# EAGLE design Xduino8.0 (EAGLE 6.5.0)
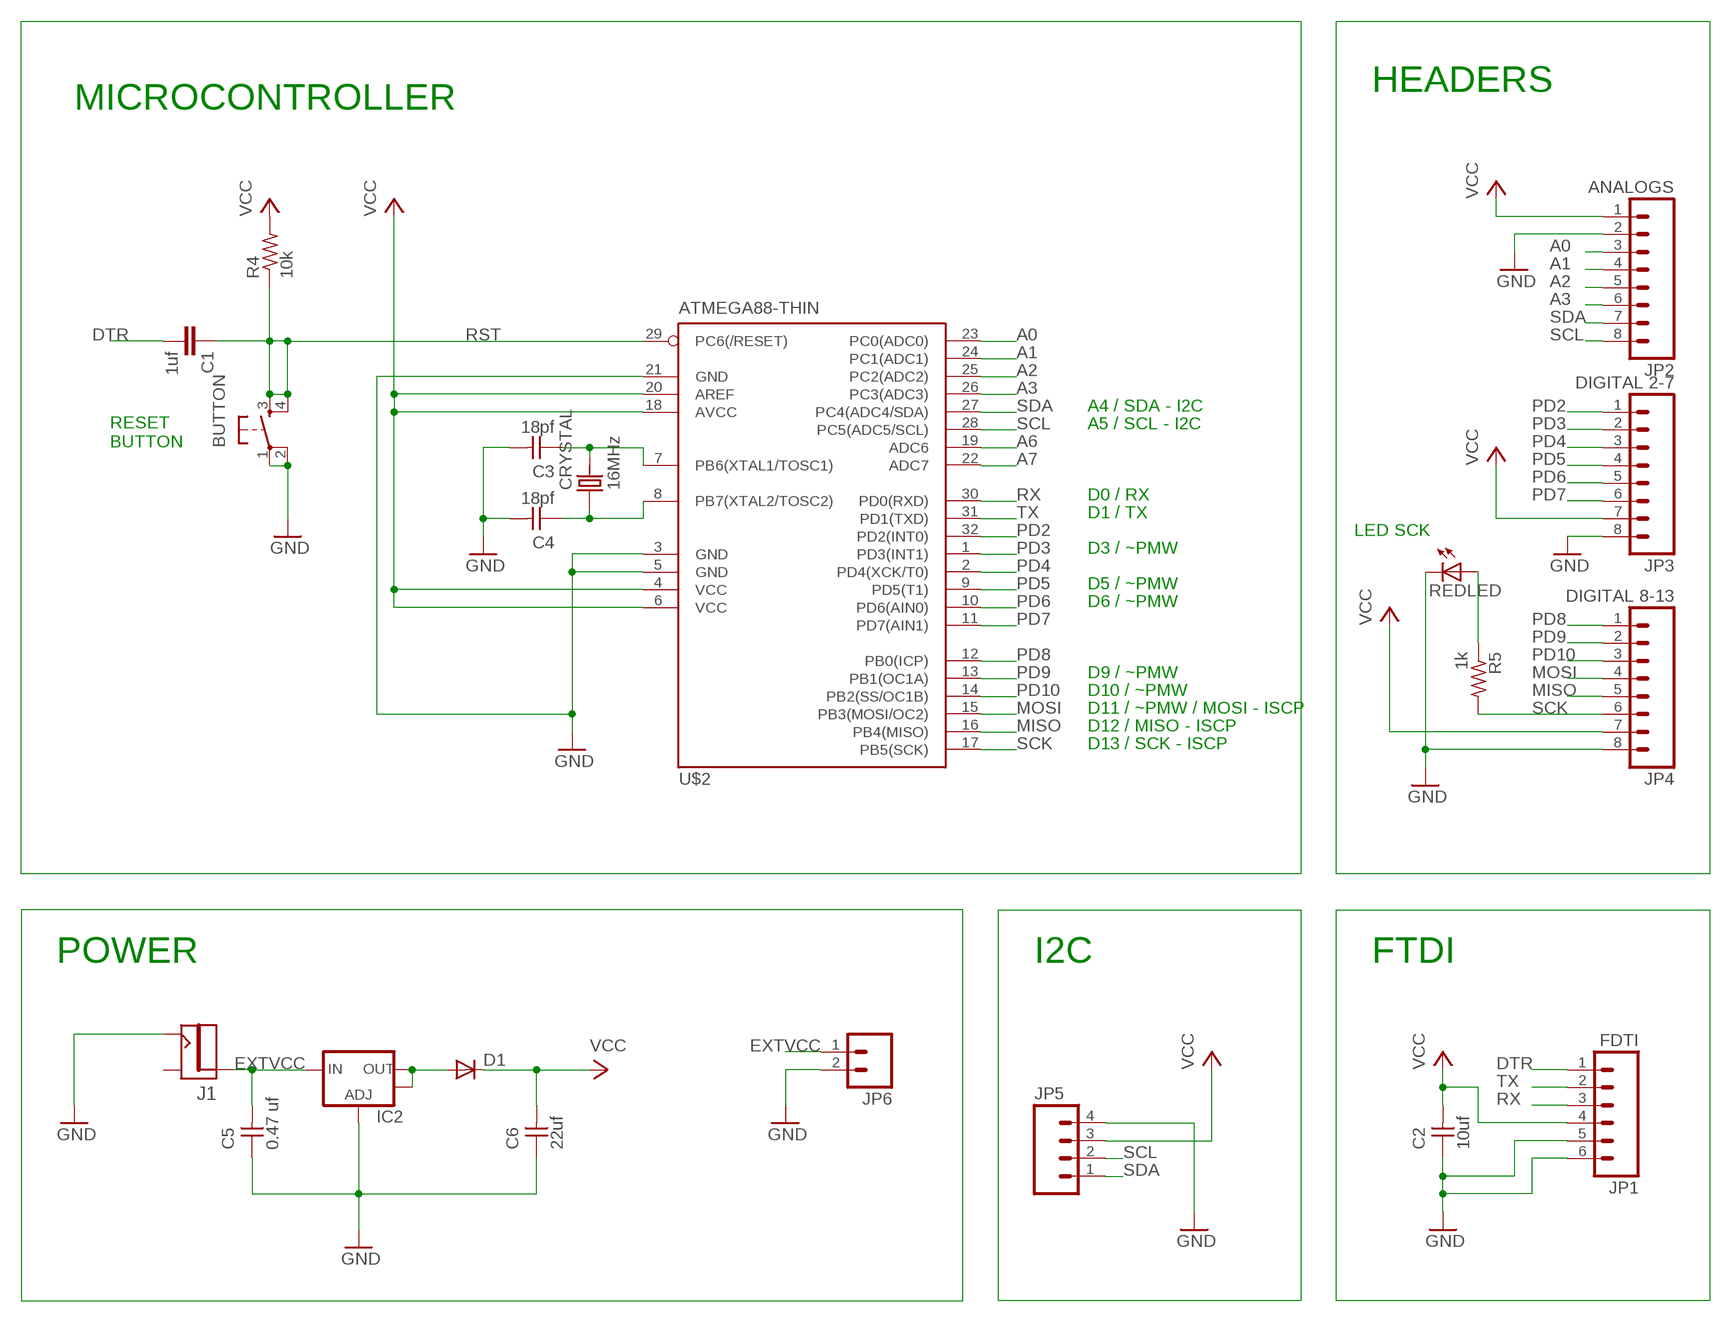
[diagram p0: schematic, sheet 1]

## Parts
BUTTON  6MM_SWITCH6MM_SWITCH  [6MM_SWITCH]
C1  1uf  CAP1206  [1206]
C2  10uf  UNPOLARIZED_CAPACITOR1206  [1206]
C3  18pf  UNPOLARIZED_CAPACITOR1206  [1206]
C4  18pf  UNPOLARIZED_CAPACITOR1206  [1206]
C5  0.47 uf  UNPOLARIZED_CAPACITOR1206  [1206]
C6  22uf  UNPOLARIZED_CAPACITOR1206  [1206]
CRYSTAL  16MHz  CRYSTALCS10  [CS10]
D1  DIODESOD123  [SOD123]
IC2  V_REG_LM1117SOT223  [SOT223]
J1  JACK.65MM  [JACK_.65MM]
JP1  FDTI  M061X06-SMD_EDGE_FEMALE  [1X06-SMD_EDGE]
JP2  ANALOGS  M08  [1X08]
JP3  DIGITAL 2-7  M08  [1X08]
JP4  DIGITAL 8-13  M08  [1X08]
JP5  M04PTH  [1X04]
JP6  M02PTH  [1X02]
R4  10k  RESISTOR1206  [1206]
R5  1k  RESISTOR1206  [1206]
REDLED  LED1206  [1206]
U$2  ATMEGA88-THIN  [TQFP32-08THIN]

## Nets
A0: JP2.3 U$2.23(PC0(ADC0))
A1: JP2.4 U$2.24(PC1(ADC1))
A2: JP2.5 U$2.25(PC2(ADC2))
A3: JP2.6 U$2.26(PC3(ADC3))
A6: U$2.19(ADC6)
A7: U$2.22(ADC7)
DTR: C1.2 JP1.1
EXTVCC: C5.2 IC2.3(IN) J1.PIN JP6.1
GND: BUTTON.1(P) BUTTON.2(P1) C2.1 C3.2 C4.2 C5.1 C6.1 IC2.1(ADJ) J1.SHUNT(CONTACT) JP1.5 JP1.6 JP2.2 JP3.8 JP4.8 JP5.4 JP6.2 REDLED.2(C) U$2.3(GND) U$2.5(GND) U$2.21(GND)
MISO: JP4.5 U$2.16(PB4(MISO))
MOSI: JP4.4 U$2.15(PB3(MOSI/OC2))
N$2: R5.1 REDLED.1(A)
N$10: C4.1 CRYSTAL.P$1 U$2.8(PB7(XTAL2/TOSC2))
N$11: C3.1 CRYSTAL.P$2 U$2.7(PB6(XTAL1/TOSC1))
N$12: D1.ANODE(A) IC2.2(OUT) IC2.4(OUT)
PD2: JP3.1 U$2.32(PD2(INT0))
PD3: JP3.2 U$2.1(PD3(INT1))
PD4: JP3.3 U$2.2(PD4(XCK/T0))
PD5: JP3.4 U$2.9(PD5(T1))
PD6: JP3.5 U$2.10(PD6(AIN0))
PD7: JP3.6 U$2.11(PD7(AIN1))
PD8: JP4.1 U$2.12(PB0(ICP))
PD9: JP4.2 U$2.13(PB1(OC1A))
PD10: JP4.3 U$2.14(PB2(SS/OC1B))
RST: BUTTON.3(S) BUTTON.4(S1) C1.1 R4.1 U$2.29(PC6(/RESET))
RX: JP1.3 U$2.30(PD0(RXD))
SCK: JP4.6 R5.2 U$2.17(PB5(SCK))
SCL: JP2.8 JP5.2 U$2.28(PC5(ADC5/SCL))
SDA: JP2.7 JP5.1 U$2.27(PC4(ADC4/SDA))
TX: JP1.2 U$2.31(PD1(TXD))
VCC: C2.2 C6.2 D1.CATHODE(C) JP1.4 JP2.1 JP3.7 JP4.7 JP5.3 R4.2 U$2.4(VCC) U$2.6(VCC) U$2.18(AVCC) U$2.20(AREF)
Unconnected: J1.CONTACT(SHUNT)

## Notes on the sheet
- HEADERS
- MICROCONTROLLER
- A4 / SDA - I2C
- A5 / SCL - I2C
- RESET 
  BUTTON
- D0 / RX
- D1 / TX
- LED SCK
- D3 / ~PMW
- D5 / ~PMW
- D6 / ~PMW
- D9 / ~PMW
- D10 / ~PMW
- D11 / ~PMW / MOSI - ISCP
- D12 / MISO - ISCP
- D13 / SCK - ISCP
- POWER | I2C | FTDI

## Library data of the parts
BUTTON = 01_fab:6MM_SWITCH: OMRON SWITCH
C1 = 01_SparkFun:CAP: Capacitor Standard 0603 ceramic capacitor, and 0.1" leaded capacitor.
C2-C6 = 01_FAB_Hello:UNPOLARIZED_CAPACITOR: unpolarized_capacitor
CRYSTAL = 01_ng:CRYSTAL: CRYSTAL
D1 = 01_fab:DIODE: DIODE high speed (Philips)
IC2 = 01_SparkFun:V_REG_LM1117: Voltage Regulator LM1117 Standard adjustable voltage regulator but in SMD form. Spark Fun Electronics SKU : COM-00595
J1 = 01_fab:JACK
JP1 = 01_SparkFun:M06: Header 6 Standard 6-pin 0.1" header. Use with straight break away headers (SKU : PRT-00116), right angle break away headers (PRT-00553), swiss pins (PRT-00743), machine pins (PRT-00117), and female headers (PRT-00115). Molex polarized connector foot print use with SKU : PRT-08094 with associated crimp pins and housings. NOTES ON THE VARIANTS LOCK and LOCK_LONGPADS... This footprint was designed to help hold the alignment of a through-hole component (i.e. 6-pin header) while soldering it into place. You may notice that each hole has been shifted either up or down by 0.005 of an inch from it's more standard position (which is a perfectly straight line). This slight alteration caused the pins (the squares in the middle) to touch the edges of the holes. Because they are alternating, it causes a "brace" to hold the component in place. 0.005 has proven to be the perfect amount of "off-center" position when using our standard breakaway headers. Although looks a little odd when you look at the bare footprint, once you have a header in there, the alteration is very hard to notice. Also, if you push a header all the way into place, it is covered up entirely on the bottom side. This idea of altering the position of holes to aid alignment will be further integrated into the Sparkfun Library for other footprints. It can help hold any component with 3 or more connection pins.
JP2-JP4 = 01_SparkFun:M08: Header 8 Standard 8-pin 0.1" header. Use with straight break away headers (SKU : PRT-00116), right angle break away headers (PRT-00553), swiss pins (PRT-00743), machine pins (PRT-00117), and female headers (PRT-00115).
JP5 = 01_SparkFun:M04: Header 4 Standard 4-pin 0.1" header. Use with straight break away headers (SKU : PRT-00116), right angle break away headers (PRT-00553), swiss pins (PRT-00743), machine pins (PRT-00117), and female headers (PRT-00115). Molex polarized connector foot print use with SKU : PRT-08231 with associated crimp pins and housings.
JP6 = 01_SparkFun:M02: Header 2 Standard 2-pin 0.1" header. Use with straight break away headers (SKU : PRT-00116), right angle break away headers (PRT-00553), swiss pins (PRT-00743), machine pins (PRT-00117), and female headers (PRT-00115). Molex polarized connector foot print use with SKU : PRT-08233 with associated crimp pins and housings.
R4 = 01_FAB_Hello:RESISTOR
R5 = 01_ng:RESISTOR
REDLED = 01_ng:LED
U$2 = 01_fab:ATMEGA88-THIN

## Board
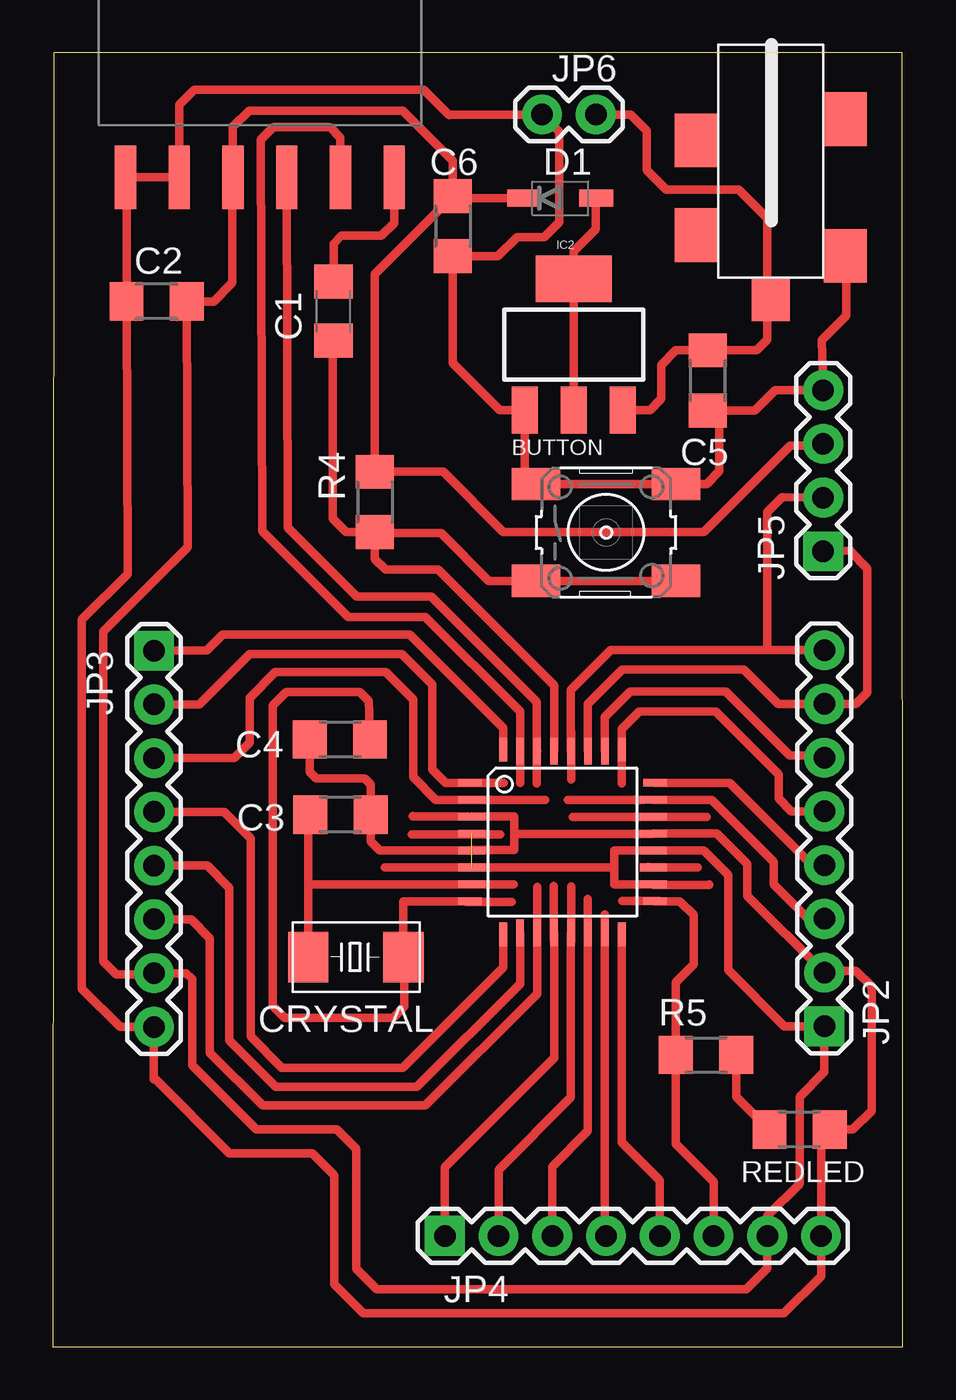
[diagram p1: board, top side]

Size 40.16 x 61.15 mm. Coordinates in mm from the lower left corner, seen from the top.
Outline: 0,0 40.16,0 40.13,61.15 0.05,61.15 0,0
Copper layers (1*16): Top 0.035mm / dielectric 1.5mm / Bottom 0.035mm
Design rules "default": minimum track width 10mil, minimum drill 24mil, track to track 8mil, track to pad 8mil, pad to pad 8mil, via to via 8mil, smd to smd 8mil, copper to edge 40mil, drill to drill 8mil, minimum pad ring 10mil, minimum via ring 8mil, stop-mask expansion 4mil, vias tented up to drill 0mil, thermal gap 10mil

### Footprints (pad centres in the part's own frame; a part is rotated, then mirrored left to right if it is on the bottom)
6MM_SWITCH = smd 2.286 x 1.524: 1 -3.302,2.286; 2 3.302,2.286; 3 -3.302,-2.286; 4 3.302,-2.286
1206 = smd 1.6 x 1.8: 1 -1.4,0; 2 1.4,0
1206' = smd 1.6 x 1.803: 1 -1.422,0; 2 1.422,0
CS10 = smd 1.905 x 2.388: P$1 -2.286,0; P$2 2.21,0
SOD123 = smd 1.6 x 0.8: ANODE 1.7,0; CATHODE -1.7,0
SOT223 = smd 1.219 x 2.235: 1 -2.311,-3.099; 2 0,-3.099; 3 2.311,-3.099 | smd 3.6 x 2.2: 4 0,3.099
JACK_.65MM = smd 2.032 x 2.54: CONTACT 3.578,4.026; SHIELD -3.45,-1.448; SHIELD1 3.578,-0.447; SHUNT -3.45,5.005 | smd 1.778 x 2.032: PIN 0.064,7.071
1X06-SMD_EDGE = smd 1 x 3: 1 0,-0.08; 2 2.54,-0.08; 3 5.08,-0.08; 4 7.62,-0.08; 5 10.16,-0.08; 6 12.7,-0.08
1X08 = drill 1.016 pad 1.88 square: 1 0,0 | drill 1.016 pad 1.88: 2 2.54,0; 3 5.08,0; 4 7.62,0; 5 10.16,0; 6 12.7,0; 7 15.24,0; 8 17.78,0
1X04 = drill 1.016 pad 1.88 square: 1 0,0 | drill 1.016 pad 1.88: 2 2.54,0; 3 5.08,0; 4 7.62,0
1X02 = drill 1.016 pad 1.88: 1 0,0; 2 2.54,0
TQFP32-08THIN = smd 1.118 x 0.356: 1 -4.369,2.8; 8 -4.369,-2.8; 17 4.369,-2.8; 24 4.369,2.8 | smd 1.27 x 0.356: 2 -4.293,2; 3 -4.293,1.2; 4 -4.293,0.4; 5 -4.293,-0.4; 6 -4.293,-1.2; 7 -4.293,-2; 18 4.293,-2; 19 4.293,-1.2; 20 4.293,-0.4; 21 4.293,0.4; 22 4.293,1.2; 23 4.293,2 | smd 0.356 x 1.118: 9 -2.8,-4.369; 16 2.8,-4.369; 25 2.8,4.369; 32 -2.8,4.369 | smd 0.356 x 1.27: 10 -2,-4.293; 14 1.2,-4.293; 15 2,-4.293; 26 2,4.293; 27 1.2,4.293; 31 -2,4.293 | smd 0.35 x 1.27: 11 -1.2,-4.293; 12 -0.4,-4.293; 13 0.4,-4.293; 28 0.4,4.293; 29 -0.4,4.293; 30 -1.2,4.293

### Placement (x,y rotation side)
BUTTON  26.14,38.48 0 top
C1  13.26,48.95 90 top
C2  10uf  [1206']  4.9,49.4 0 top
C3  18pf  [1206']  13.59,25.15 0 top
C4  18pf  [1206']  13.56,28.7 180 top
C5  0.47 uf  [1206']  30.94,45.67 90 top
C6  22uf  [1206']  18.9,52.96 90 top
CRYSTAL  14.27,18.41 180 top
D1  23.98,54.28 0 top
IC2  24.61,47.37 0 top
J1  33.99,56.57 180 top
JP1  16.13,55.19 180 top
JP2  36.45,15.14 90 top
JP3  4.78,32.89 270 top
JP4  18.52,5.23 0 top
JP5  36.4,37.59 90 top
JP6  25.65,58.24 180 top
R4  10k  [1206']  15.21,39.93 90 top
R5  1k  [1206']  30.86,13.79 180 top
REDLED  [1206']  35.28,10.26 0 top
U$2  24.08,23.85 0 top

### Tracks (layer width: path | path; a pad name or v marks a point on that pad's centre or on a via)
A0
  Top 0.406: U$2.23 31.12,25.85 34.06,22.91 34.06,21.84 35.69,20.22 JP2.3
A1
  Top 0.406: U$2.24 31.97,26.65 35.86,22.76 JP2.4
A2
  Top 0.406: U$2.25 26.88,29.19 27.71,30.02 31.32,30.02 34.29,27.05 34.29,25.91 34.9,25.3 JP2.5
A3
  Top 0.406: U$2.26 26.08,29.76 27.28,30.96 31.8,30.96 34.82,27.94 36.35,27.94 JP2.6
DTR
  Top 0.406: C1.2 13.26,52.15 13.61,52.5 15.52,52.5 16.13,53.11 JP1.1
EXTVCC
  Top 0.406: JP6.1 27.31,58.24 28.07,57.48 28.07,55.6 28.98,54.69 32.41,54.69 33.75,53.34 33.75,49.33 | 33.75,49.33 J1.PIN | 33.75,49.33 33.75,47.6 33.25,47.09 30.18,47.09 C5.2 29.44,47.09 28.75,46.41 28.75,44.81 28.22,44.27 IC2.3
GND
  Top 0.406: U$2.3 21.79,25.05 21.79,24.23 | 21.79,24.23 21.79,23.47 19.79,23.47 U$2.5 15.44,23.45 15.01,23.88 C3.2 | 21.79,24.23 28.37,24.23 U$2.21 31.38,24.25 32.82,22.81 32.82,21.31 JP2.2 36.53,17.75 37.95,17.75 38.68,17.02 38.68,11.15 37.8,10.26 REDLED.2 36.3,9.86 JP4.8 36.3,3.33 34.54,1.57 14.66,1.57 13.28,2.95 13.28,8.1 12.24,9.14 8.33,9.14 4.85,12.62 4.78,12.62 JP3.8 3.18,15.11 1.37,16.92 1.37,34.37 3.53,36.53 C2.1 3.48,55.22 JP1.6 JP1.5 5.97,58.7 6.65,59.39 6.73,59.41 17.53,59.41 18.72,58.22 18.75,58.24 JP6.2 23.93,57.43 23.93,53.16 23.22,52.45 21.95,52.45 21.03,51.54 C6.1 18.9,46.48 21.11,44.27 IC2.1 22.3,41.3 BUTTON.1 BUTTON.2 30.89,40.77 31.5,41.38 31.5,43.69 C5.1 33.17,44.25 34.14,45.21 JP5.4 36.32,47.57 37.49,48.74 37.49,51.51 J1.SHUNT 37.47,51.53 | C3.2 | C3.2 15.01,26.57 14.73,26.85 12.45,26.85 12.14,27.15 C4.2 | C4.2
MISO
  Top 0.406: U$2.16 26.88,9.65 28.68,7.85 JP4.5
MOSI
  Top 0.406: U$2.15 26.08,5.51 JP4.4
N$1
  Top 0.406: 24.56,25.04 30.89,25.04
N$2
  Top 0.406: REDLED.1 33.83,10.26 32.28,11.81 R5.1
N$5
  Top 0.406: 28.12,22.68 28.14,22.68 28.17,22.66 30.48,22.66
N$10
  Top 0.406: U$2.8 16.56,21.05 CRYSTAL.P$1 16.61,18.36 16.61,16.08 16.08,15.54 10.95,15.54 10.39,16.1 10.39,30.3 11.02,30.94 14.5,30.94 14.93,30.51 C4.1
N$11
  Top 0.406: CRYSTAL.P$2 12.07,21.95 | 12.07,21.95 12.07,24.38 C3.1 | U$2.7 12.16,21.85 12.07,21.95
N$12
  Top 0.406: D1.ANODE 25.65,54.26 25.65,52.83 24.61,51.79 IC2.4 IC2.2
N$15
  Top 0.406: 21.13,24.21 16.97,24.21
N$20
  Top 0.406: 19.56,25.83 23.27,25.83
N$21
  Top 0.406: 27.91,25.83 24.33,25.83
N$23
  Top 0.406: 25.27,19.3 25.27,21.16
N$24
  Top 0.406: 24.49,19.13 24.49,21.74
N$25
  Top 0.406: 23.67,19.23 23.67,21.77
N$26
  Top 0.406: 22.89,19.28 22.89,21.72
N$27
  Top 0.406: 19.61,21.84 21.77,21.84
N$28
  Top 0.406: 19.51,21.03 21.69,21.03
N$29
  Top 0.406: 28.65,21.06 26.9,21.06
N$30
  Top 0.406: 19.51,26.64 21.31,26.64
N$31
  Top 0.406: 24.49,29.06 24.49,26.8
N$32
  Top 0.406: 26.87,28.68 26.87,26.62
N$34
  Top 0.406: 26.09,19.28 26.09,20.42
N$35
  Top 0.406: 19.58,25.07 16.99,25.07 16.99,25.1
N$36
  Top 0.406: 28.37,21.82 31.01,21.82 31.01,21.84
PD2
  Top 0.406: 4.78,32.92 JP3.1 7.26,32.89 8.03,33.65 16.87,33.65 21.28,29.24 U$2.32
PD3
  Top 0.406: U$2.1 18.56,26.65 17.93,27.28 17.93,31.29 16.48,32.74 9.3,32.74 6.91,30.35 JP3.2
PD4
  Top 0.406: U$2.2 18.09,25.85 17.02,26.92 17.02,30.58 15.72,31.88 10.52,31.88 9.3,30.66 9.3,28.55 8.56,27.81 JP3.3
PD5
  Top 0.406: JP3.4 8.1,25.27 9.35,24.03 9.35,14.66 10.82,13.18 16.54,13.18 21.28,17.93 U$2.9
PD6
  Top 0.406: JP3.5 7.29,22.73 8.33,21.69 8.33,14.48 10.54,12.27 17.2,12.27 22.08,17.15 U$2.10
PD7
  Top 0.406: JP3.6 6.53,20.19 7.42,19.3 7.42,13.89 9.91,11.4 17.6,11.4 22.88,16.68 U$2.11
PD8
  Top 0.406: U$2.12 23.68,13.65 18.52,8.48 JP4.1
PD9
  Top 0.406: U$2.13 24.48,11.78 21.06,8.36 JP4.2
PD10
  Top 0.406: U$2.14 25.28,10.19 23.6,8.51 JP4.3
RST
  Top 0.406: BUTTON.4 BUTTON.3 20.6,36.19 18.34,38.46 15.27,38.46 R4.1 | U$2.29 23.68,31.26 18.21,36.73 15.72,36.73 15.21,37.24 R4.1 | R4.1 13.87,38.51 13.23,39.14 13.23,47.52 C1.1
RX
  Top 0.406: 22.86,28.16 22.86,30.48 17.88,35.46 14.35,35.46 11.1,38.71 JP1.3 | 22.86,28.16 U$2.30 | 22.86,28.16 22.86,26.62
SCK
  Top 0.406: U$2.17 29.62,21.05 30.28,20.4 30.28,18.06 29.44,17.22 R5.2 29.44,9.58 31.22,7.8 JP4.6
SCL
  Top 0.406: 24.46,28.16 U$2.28 24.48,31.03 26.37,32.92 33.63,32.92 | 33.63,32.92 JP2.8 | JP5.2 34.47,40.16 33.76,39.45 33.76,33.05 33.63,32.92
SDA
  Top 0.406: U$2.27 25.28,30.38 26.9,32 32.64,32 34.26,30.38 JP2.7 37.95,30.38 38.48,30.91 38.48,36.78 37.64,37.62 JP5.1
TX
  Top 0.406: U$2.31 22.07,30.02 17.6,34.49 13.94,34.49 9.88,38.56 9.83,57.05 10.41,57.63 13.11,57.63 13.59,57.15 JP1.2 | U$2.31 | U$2.31 22.07,26.64
VCC  (1 unrouted)
  Top 0.406: U$2.20 | 26.52,22.66 U$2.6 15.68,22.65 15.67,22.66 | U$2.20 26.52,23.45 26.52,22.66 | U$2.18 26.52,21.85 26.52,22.66 | U$2.20 30.76,23.45 30.76,23.44 31.9,22.3 31.9,17.81 34.57,15.14 JP2.1 36.45,12.98 35.28,11.81 35.28,7.7 33.76,6.17 JP4.7 33.76,3.71 32.77,2.72 15.29,2.72 14.33,3.68 14.33,9.35 13.41,10.26 9.6,10.26 6.58,13.28 6.58,17.37 6.3,17.65 JP3.7 4.72,17.6 3,17.6 2.39,18.21 2.39,33.81 6.38,37.79 C2.2 7.59,49.4 8.48,50.29 8.48,55.25 JP1.4 8.51,57.66 9.27,58.42 16.54,58.42 18.9,56.06 C6.2 | D1.CATHODE 19,54.28 C6.2 | JP5.3 36.32,42.6 34.85,42.6 30.76,38.51 21.29,38.51 18.44,41.35 R4.2 15.21,50.7 C6.2